# Altium schematic sheet 官方方案V1.SchDoc
size A4
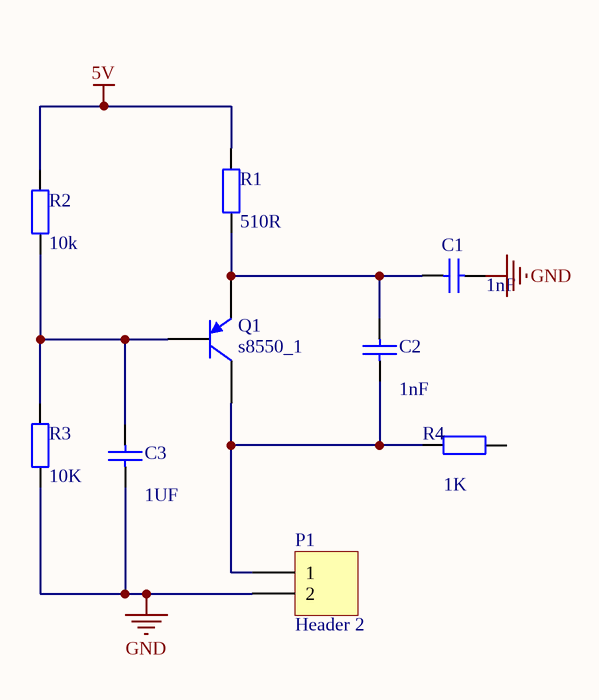
[diagram p0: 官方方案V1.SchDoc]

## Parts
C1  value 1nF  [RAD-0.3]  (hidden comment: Cap)
C2  value 1nF  [RAD-0.3]  (hidden comment: Cap)
C3  value 1UF  [RAD-0.3]  (hidden comment: Cap)
P1  Header 2  [HDR1X2]
Q1  s8550_1  [TO-92A]
R1  value 510R  [AXIAL-0.4]  (hidden comment: Res2)
R2  value 10k  [AXIAL-0.4]  (hidden comment: Res2)
R3  value 10K  [AXIAL-0.4]  (hidden comment: Res2)
R4  value 1K  [AXIAL-0.4]  (hidden comment: Res2)

## Nets
5V: R1.2 R2.2
GND: C1.2 C3.1 P1.2 R3.1
NetC1_1: C1.1 C2.2 Q1.1(E) R1.1
NetC2_1: C2.1 P1.1 Q1.3(C) R4.2
NetC3_2: C3.2 Q1.2(B) R2.1 R3.2

Not connected (* = marked no-connect by the designer): R4 1

## Library data of the parts
C1-C3 = Cap: Capacitor; Published: 8-Jun-2000; LatestRevisionDate: 17-Jul-2002; LatestRevisionNote: Re-released for DXP Platform.; PackageReference: RAD-0.3; Publisher: Altium Limited; PackageDescription: Radial Cap, Thru-Hole; 2 Leads; 0.3 in Pin Spacing
P1 = Header 2: Header, 2-Pin; LatestRevisionDate: 17-Jul-2002; LatestRevisionNote: Re-released for DXP Platform.; Publisher: Altium Limited
Q1 = 2N3906: PNP General Purpose Amplifier; Published: 8-Jun-2000; LatestRevisionDate: 15-Jan-2003; LatestRevisionNote: PCB Footprint 'BCY-W3/D4.7' replaced; DatasheetVersion: 1997; PackageVersion: Sep-1998; PackageReference: TO-92A; Publisher: Altium Limited; PackageDescription: TO, Flat Index; 3 In-Line, Axial Leads; Body Dia. 4.5mm; Leads 0.51 x 0.48 mm (max); ComponentLink1Description: Manufacturer Link; ComponentLink1URL: http://www.fairchildsemi.com/; ComponentLink2Description: Datasheet; ComponentLink2URL: http://www.fairchildsemi.com/ds/2N%2F2N3906.pdf
R1-R4 = Res2: Resistor; Published: 8-Jun-2000; LatestRevisionDate: 17-Jul-2002; LatestRevisionNote: Re-released for DXP Platform.; PackageReference: AXIAL-0.4; Publisher: Altium Limited; PackageDescription: Axial Device, Thru-Hole; 2 Leads; 0.4 in Pin Spacing